# EAGLE design ehomePower (EAGLE 8.7.0)
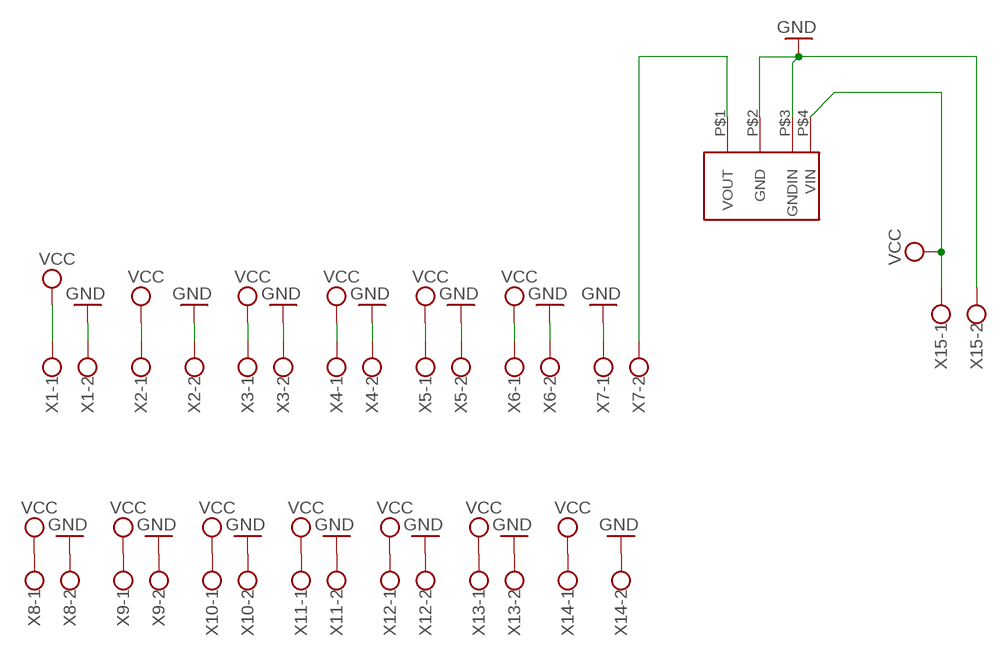
[diagram p0: schematic, sheet 1]

## Parts
U$2  AM2DS  [AM2DS]
X1  W237-102  [W237-102]
X2  W237-102  [W237-102]
X3  W237-102  [W237-102]
X4  W237-102  [W237-102]
X5  W237-102  [W237-102]
X6  W237-102  [W237-102]
X7  W237-102  [W237-102]
X8  W237-102  [W237-102]
X9  W237-102  [W237-102]
X10  W237-102  [W237-102]
X11  W237-102  [W237-102]
X12  W237-102  [W237-102]
X13  W237-102  [W237-102]
X14  W237-102  [W237-102]
X15  W237-102  [W237-102]

## Nets
GND: U$2.P$2(GND) U$2.P$3(GNDIN) X1.2 X2.2 X3.2 X4.2 X5.2 X6.2 X7.1 X8.2 X9.2 X10.2 X11.2 X12.2 X13.2 X14.2 X15.2
N$1: U$2.P$1(VOUT) X7.2
VCC: U$2.P$4(VIN) X1.1 X2.1 X3.1 X4.1 X5.1 X6.1 X8.1 X9.1 X10.1 X11.1 X12.1 X13.1 X14.1 X15.1

## Library data of the parts
U$2 = personal:AM2DS
X1-X15 = con-wago-500:W237-102: WAGO SCREW CLAMP; MPN: 237-102; OC_FARNELL: unknown; OC_NEWARK: 70K9898

## Board
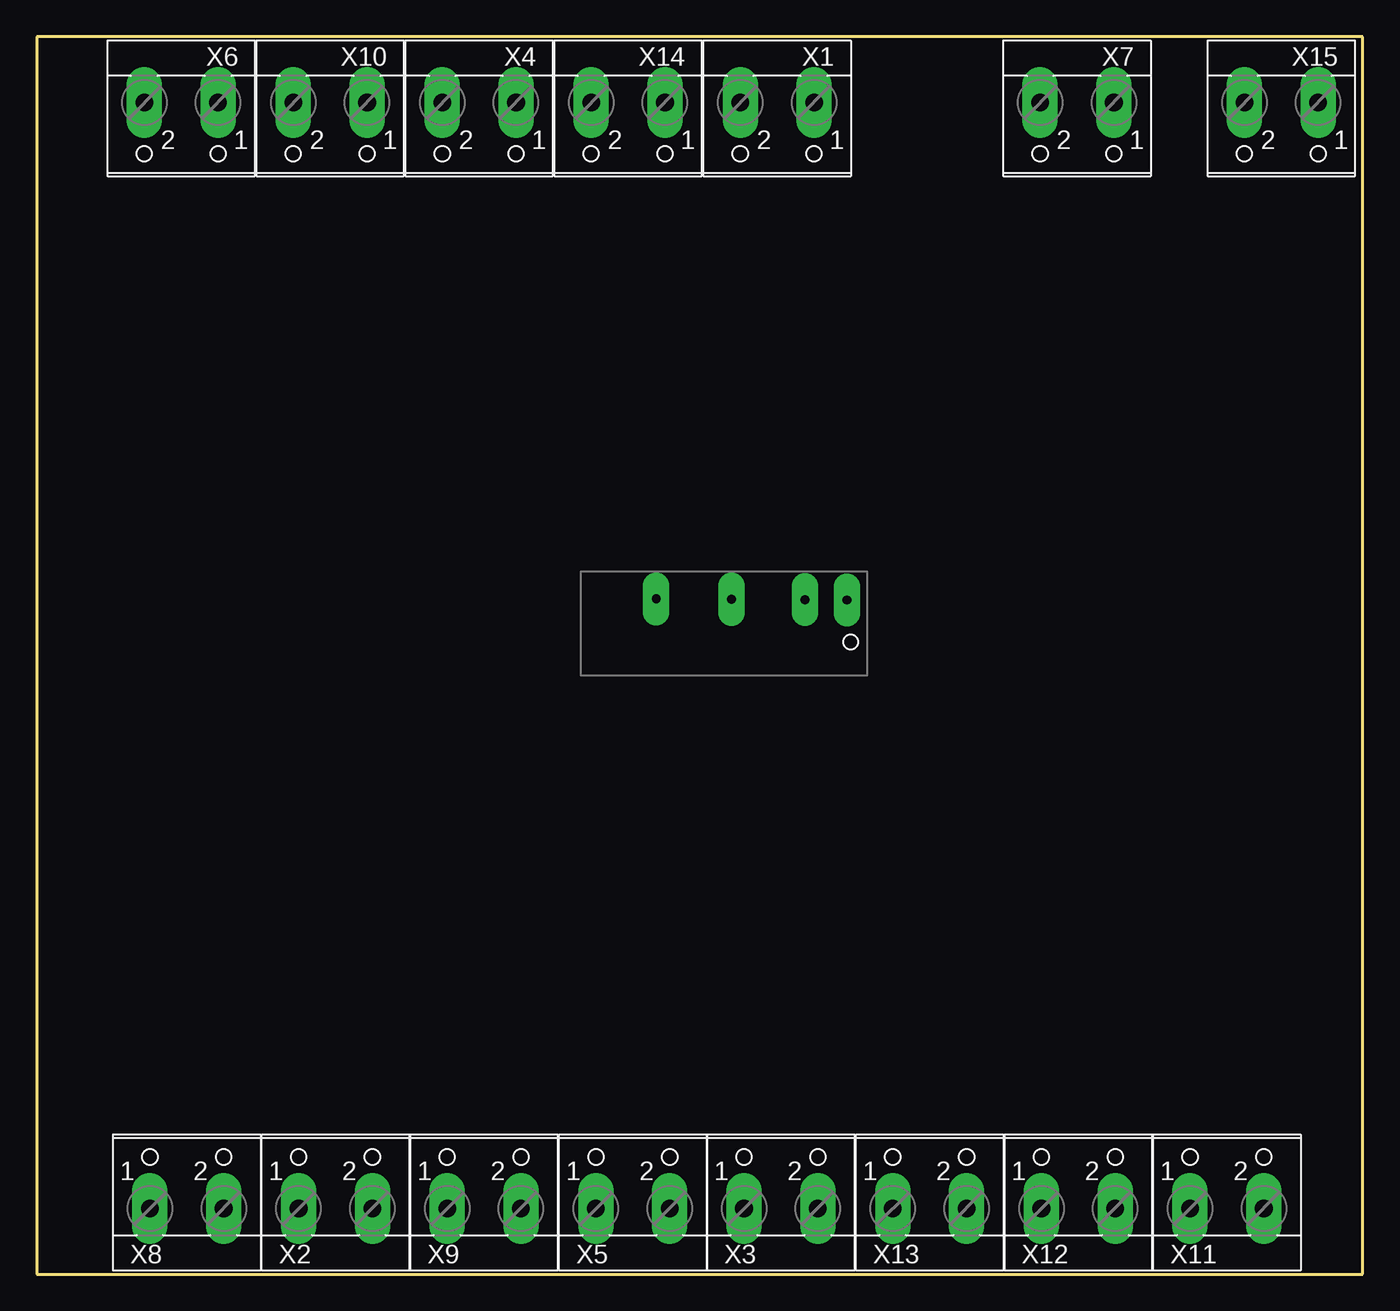
[diagram p1: board, top side]
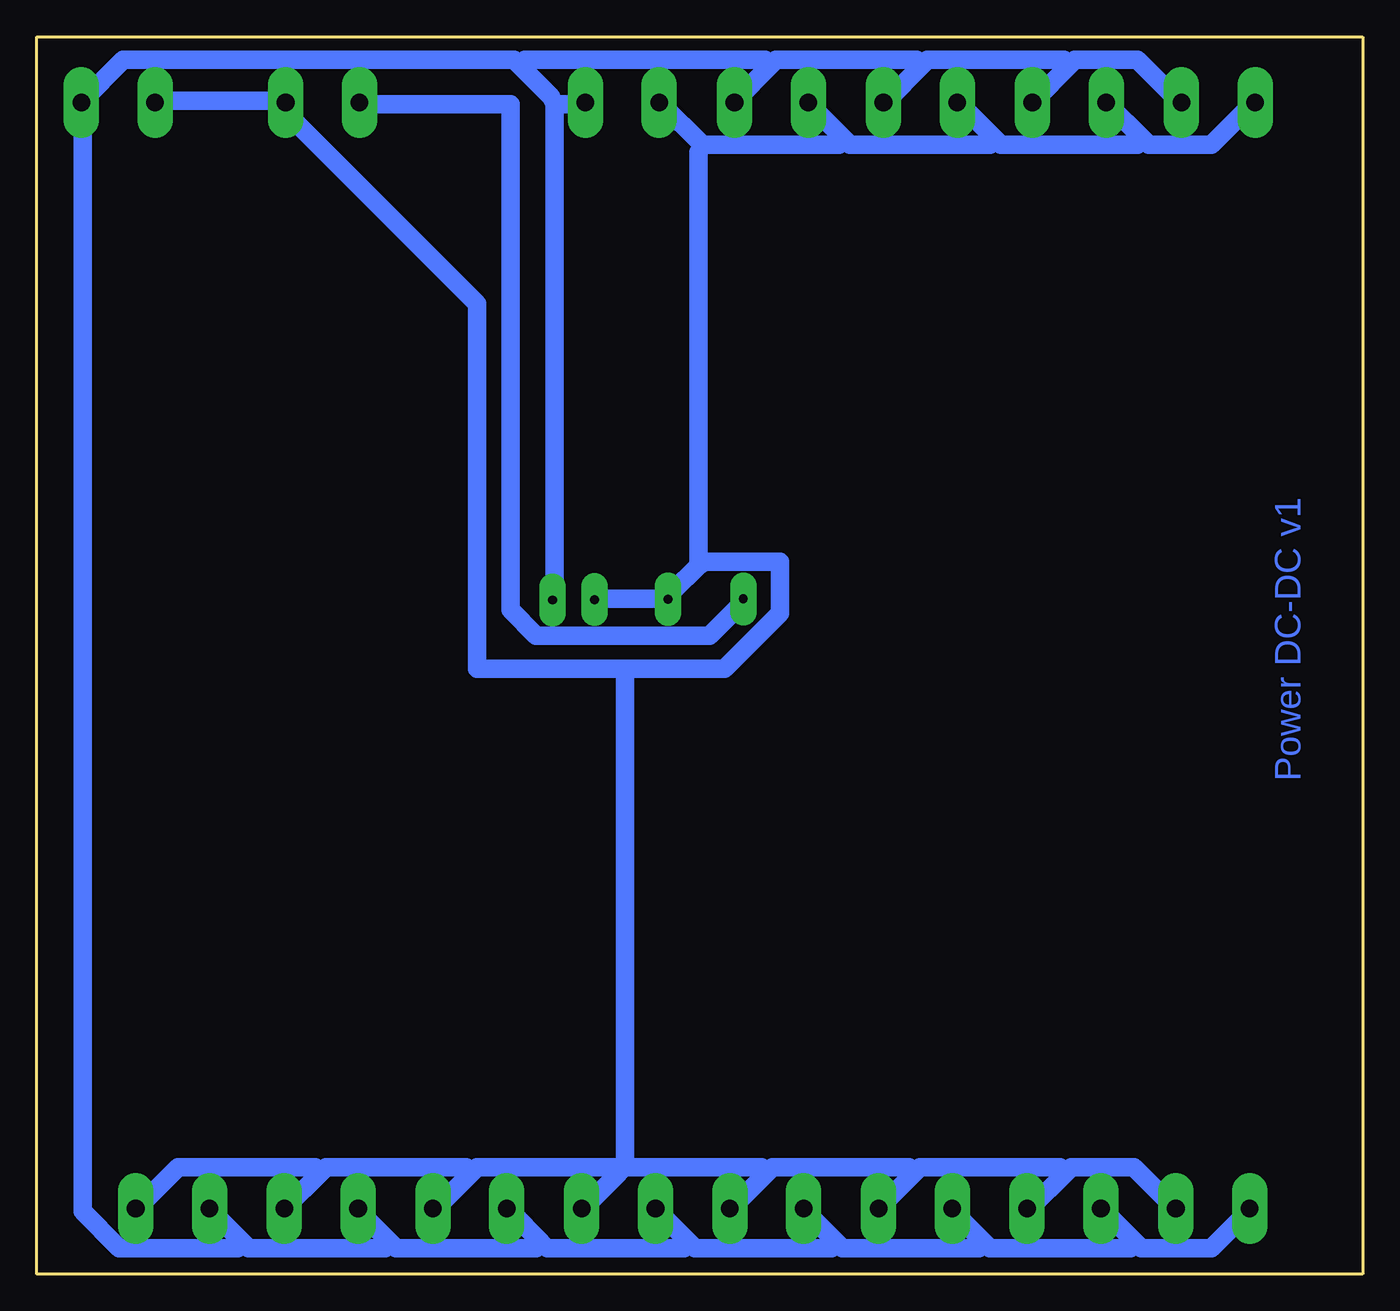
[diagram p2: board, bottom side, seen from below]

Size 89.84 x 83.81 mm. Coordinates in mm from the lower left corner, seen from the top.
Outline: 0,0 89.84,0 89.84,83.81 0,83.81 0,0
Copper layers (1*16): Top 0.035mm / dielectric 1.5mm / Bottom 0.035mm
Design rules "hobby *": minimum track width 50mil, minimum drill 0.8mm, track to track 0.8mm, track to pad 0.8mm, pad to pad 0.45mm, via to via 0.8mm, smd to smd 8mil, copper to edge 10mil, drill to drill 8mil, minimum pad ring 0.6mm, minimum via ring 0.6mm, stop-mask expansion 0mil, vias tented up to drill 0mil, thermal gap 10mil

### Footprints (pad centres in the part's own frame; a part is rotated, then mirrored left to right if it is on the bottom)
AM2DS = drill 0.6 long: P$1 5.14,5.1; P$2 10.245,5.075; P$3 15.22,5.05; P$4 18.06,5.025
W237-102 = drill 1.194 long: 1 -2.5,-1.27; 2 2.5,-1.27

### Placement (x,y rotation side)
U$2  36.83,40.64 0 top
X1  50.16,78.11 180 top
X2  20.24,5.71 0 top
X3  50.42,5.71 0 top
X4  29.97,78.11 180 top
X5  40.39,5.71 0 top
X6  9.78,78.11 180 top
X7  70.48,78.11 180 top
X8  10.16,5.71 0 top
X9  30.31,5.71 0 top
X10  19.88,78.11 180 top
X11  80.65,5.71 0 top
X12  70.57,5.71 0 top
X13  60.5,5.71 0 top
X14  40.06,78.11 180 top
X15  84.33,78.11 180 top

### Tracks (layer width: path | path; a pad name or v marks a point on that pad's centre or on a via)
GND
  Bottom 1.27: 20.12,6.88 22.5,4.5 X2.2 | 20.12,6.88 19.75,7.25 15.5,7.25 12.75,4.5 X8.2 | 30.38,6.88 30,7.25 20.5,7.25 20.12,6.88 | 30.38,6.88 32.75,4.5 X9.2 | 40.38,6.88 40,7.25 30.75,7.25 30.38,6.88 | 40.38,6.88 42.75,4.5 X5.2 | 50,7.25 50.38,6.88 | 50.38,6.88 52.75,4.5 X3.2 | 50,7.25 40.75,7.25 40.38,6.88 | 60.38,6.88 60,7.25 50.75,7.25 50.38,6.88 | 60.38,6.88 62.75,4.5 X13.2 | 70.62,6.88 70.25,7.25 60.75,7.25 60.38,6.88 | 70.62,6.88 73,4.5 X12.2 | X11.2 83,4.5 80.25,7.25 71,7.25 70.62,6.88 | X15.2 81.75,79.5 73,79.5 X7.1 73,78.75 60,65.75 60,41 50,41 | U$2.P$3 52,45.75 47.25,45.75 U$2.P$2 46.75,46.25 45,48 | 14.88,76.88 17.25,79.25 X10.2 | 14.88,76.88 14.5,76.5 10.25,76.5 7.5,79.25 X6.2 | 24.88,76.88 24.5,76.5 15.25,76.5 14.88,76.88 | 24.88,76.88 27.25,79.25 X4.2 | 35.12,76.88 34.75,76.5 25.25,76.5 24.88,76.88 | 35.12,76.88 37.5,79.25 X14.2 | 44.75,76.5 47.5,79.25 X1.2 | 44.75,76.5 35.5,76.5 35.12,76.88 | 45,48 45,76 44.75,76.5 | 50,41 43.25,41 39.5,44.75 39.5,48.25 44.5,48.25 45,48 | 50,41 50,7.25
N$1
  Bottom 1.27: U$2.P$1 42,45.5 44.25,43.25 56,43.25 57.75,45 57.75,79.25 67.75,79.25 X7.2
VCC
  Bottom 1.27: 15.38,2.12 17.5,4.25 X2.1 | 15.38,2.12 15,1.75 10.25,1.75 7.75,4.25 X8.1 | 25.62,2.12 25.25,1.75 15.75,1.75 15.38,2.12 | 25.62,2.12 27.75,4.25 X9.1 | 35.62,2.12 35.25,1.75 26,1.75 25.62,2.12 | 35.62,2.12 37.75,4.25 X5.1 | 45.62,2.12 45.25,1.75 36,1.75 35.62,2.12 | 45.62,2.12 47.75,4.25 X3.1 | 55.62,2.12 55.25,1.75 46,1.75 45.62,2.12 | 55.62,2.12 57.75,4.25 X13.1 | 65.88,2.12 65.5,1.75 56,1.75 55.62,2.12 | 65.88,2.12 68,4.25 X12.1 | 75.88,2.12 75.5,1.75 66.25,1.75 65.88,2.12 | 75.88,2.12 78,4.25 X11.1 | 19.88,81.88 22.25,79.5 X10.1 | 19.88,81.88 19.5,82.25 15.25,82.25 12.5,79.5 X6.1 | 29.88,81.88 29.5,82.25 20.25,82.25 19.88,81.88 | 29.88,81.88 32.25,79.5 X4.1 | 40.12,81.88 39.75,82.25 30.25,82.25 29.88,81.88 | 40.12,81.88 42.5,79.5 X14.1 | 54.75,79.25 54.75,45.75 U$2.P$4 | 54.75,79.25 52.75,79.25 X1.1 | 57.12,81.88 55,79.75 54.75,79.25 | 57.12,81.88 57.5,82.25 84,82.25 86.75,79.5 X15.1 86.75,78.75 86.75,4.25 84.25,1.75 76.25,1.75 75.88,2.12 | 40.12,81.88 40.5,82.25 56.75,82.25 57.12,81.88

### Text on the board
Bottom: Power DC-DC v1